# EasyEDA schematic SCH_Easy-eda-E-xmas-board_2024-12-05.json
TITLE: Sheet_1; REV: 1.0; Date: 2024-12-03; Sheet: 1/1; Drawn By: arrow007; Company: Your Company
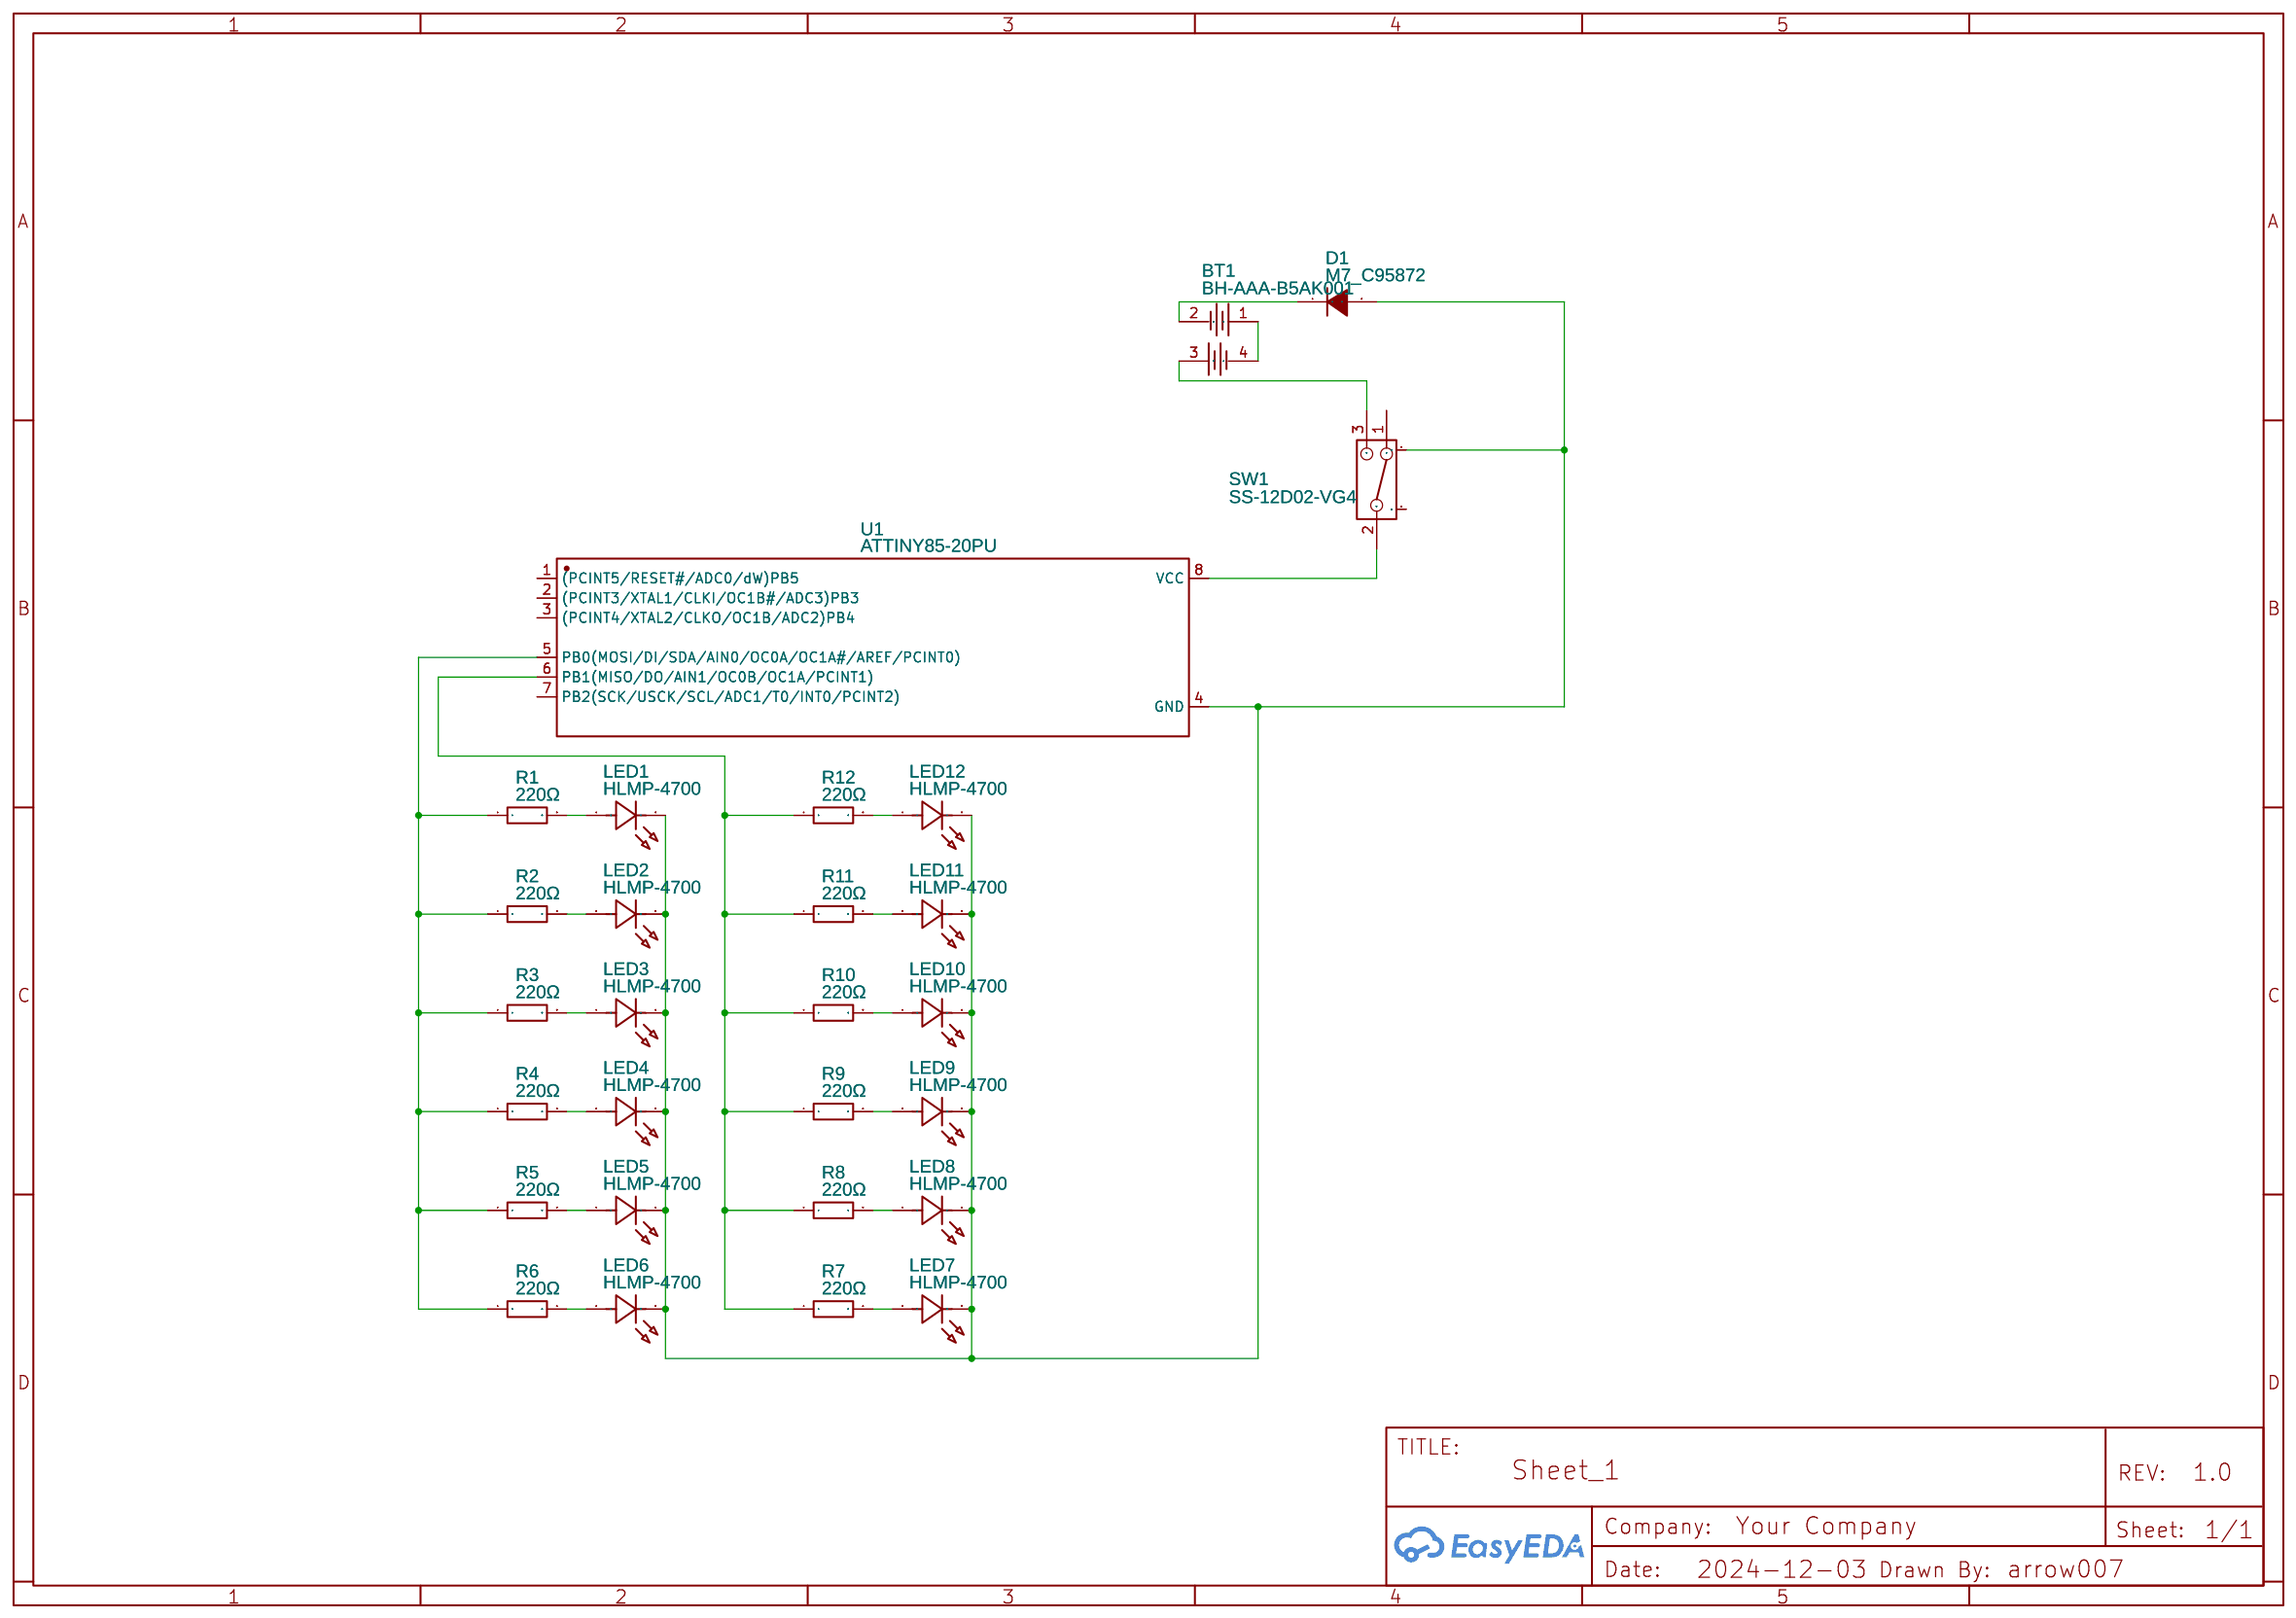
[diagram p0: schematic sheet]

## Parts
BT1  BH-AAA-B5AK001  [BAT-SMD_BH-AAA-B5AA001]
D1  M7_C95872  [SMA_L4.3-W2.6-LS5.2-RD]
LED1  HLMP-4700  [LED-TH_BD5.8-P2.54-FD]
LED2  HLMP-4700  [LED-TH_BD5.8-P2.54-FD]
LED3  HLMP-4700  [LED-TH_BD5.8-P2.54-FD]
LED4  HLMP-4700  [LED-TH_BD5.8-P2.54-FD]
LED5  HLMP-4700  [LED-TH_BD5.8-P2.54-FD]
LED6  HLMP-4700  [LED-TH_BD5.8-P2.54-FD]
LED7  HLMP-4700  [LED-TH_BD5.8-P2.54-FD]
LED8  HLMP-4700  [LED-TH_BD5.8-P2.54-FD]
LED9  HLMP-4700  [LED-TH_BD5.8-P2.54-FD]
LED10  HLMP-4700  [LED-TH_BD5.8-P2.54-FD]
LED11  HLMP-4700  [LED-TH_BD5.8-P2.54-FD]
LED12  HLMP-4700  [LED-TH_BD5.8-P2.54-FD]
R1  220Ω  [R0402]
R2  220Ω  [R0402]
R3  220Ω  [R0402]
R4  220Ω  [R0402]
R5  220Ω  [R0402]
R6  220Ω  [R0402]
R7  220Ω  [R0402]
R8  220Ω  [R0402]
R9  220Ω  [R0402]
R10  220Ω  [R0402]
R11  220Ω  [R0402]
R12  220Ω  [R0402]
SW1  SS-12D02-VG4  [SW-TH_SS-12D02-VG4]
U1  ATTINY85-20PU  [PDIP-8_L9.3-W6.4-P2.54-LS7.9-BL-1]

## Library data of the parts
BT1 = BH-AAA-B5AK001: Contributor: LCSC; Supplier: LCSC; Supplier Part: C964882; Manufacturer: MYOUNG(美阳); JLCPCB Part Class: Extended Part
D1 = M7_C95872: Supplier: LCSC; Manufacturer: MDD(辰达半导体); Manufacturer Part: M7; Supplier Part: C95872; JLCPCB Part Class: Basic Part
LED1-LED12 = HLMP-4700: Contributor: lcsc; Supplier: LCSC; Supplier Part: C2686007; Manufacturer: Broadcom/AVAGO(安华高); JLCPCB Part Class: Extended Part
R1-R12 = RM04JTN221: Contributor: LCSC; Supplier: LCSC; Manufacturer: 大毅科技; Supplier Part: C162901; JLCPCB Part Class: Extended Part
SW1 = SS-12D02-VG4: Contributor: LCSC; Supplier: LCSC; Supplier Part: C136719; Manufacturer: 韩国韩荣; JLCPCB Part Class: Extended Part
U1 = ATTINY85-20PU: Contributor: LCSC; Supplier: LCSC; Supplier Part: C965497; Manufacturer: MICROCHIP(美国微芯); JLCPCB Part Class: Extended Part

## Nets
Net-(BT1-1): BT1.1 BT1.4
Net-(BT1-2): BT1.2 D1.1(K)
Net-(BT1-3): BT1.3 SW1.3
Net-(D1-2): D1.2(A) LED1.2(K) LED2.2(K) LED3.2(K) LED4.2(K) LED5.2(K) LED6.2(K) LED7.2(K) LED8.2(K) LED9.2(K) LED10.2(K) LED11.2(K) LED12.2(K) SW1.4 U1.4(GND)
Net-(LED1-1): LED1.1(A) R1.2
Net-(LED2-1): LED2.1(A) R2.2
Net-(LED3-1): LED3.1(A) R3.2
Net-(LED4-1): LED4.1(A) R4.2
Net-(LED5-1): LED5.1(A) R5.2
Net-(LED6-1): LED6.1(A) R6.2
Net-(LED7-1): LED7.1(A) R7.2
Net-(LED8-1): LED8.1(A) R8.2
Net-(LED9-1): LED9.1(A) R9.2
Net-(LED10-1): LED10.1(A) R10.2
Net-(LED11-1): LED11.1(A) R11.2
Net-(LED12-1): LED12.1(A) R12.2
Net-(R1-1): R1.1 R2.1 R3.1 R4.1 R5.1 R6.1 U1.5(PB0(MOSI/DI/SDA/AIN0/OC0A/OC1A#/AREF/PCINT0))
Net-(R7-1): R7.1 R8.1 R9.1 R10.1 R11.1 R12.1 U1.6(PB1(MISO/DO/AIN1/OC0B/OC1A/PCINT1))
Net-(SW1-2): SW1.2 U1.8(VCC)

Not connected (* = marked no-connect by the designer): SW1 1 5; U1 1((PCINT5/RESET#/ADC0/dW)PB5) 2((PCINT3/XTAL1/CLKI/OC1B#/ADC3)PB3) 3((PCINT4/XTAL2/CLKO/OC1B/ADC2)PB4) 7(PB2(SCK/USCK/SCL/ADC1/T0/INT0/PCINT2))
